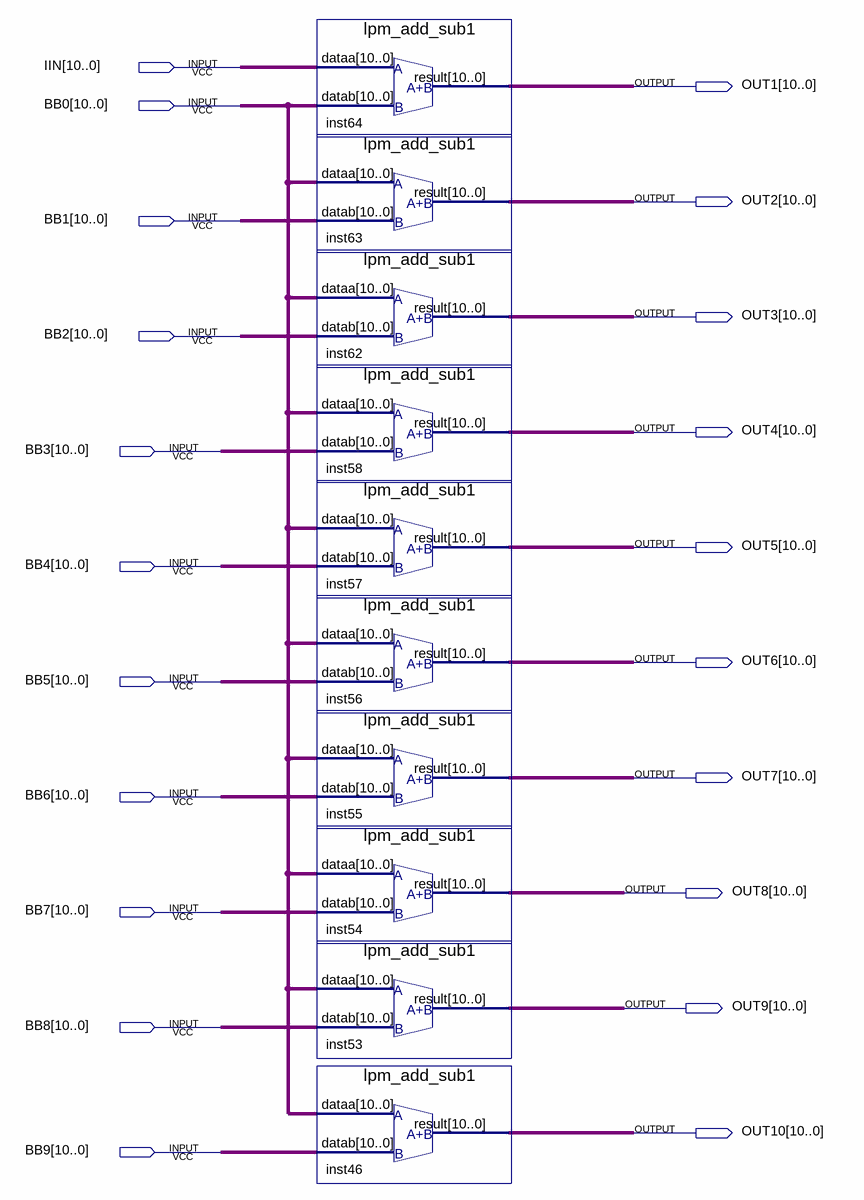
[diagram p0: schematic sheet]
// Quartus schematic ADDALL2.bdf as structural Verilog: 10 symbols, 21 pins
module ADDALL2 (
  input  [10:0] IIN,
  input  [10:0] BB0,
  input  [10:0] BB1,
  input  [10:0] BB2,
  input  [10:0] BB3,
  input  [10:0] BB4,
  input  [10:0] BB5,
  input  [10:0] BB6,
  input  [10:0] BB7,
  input  [10:0] BB8,
  input  [10:0] BB9,
  output [10:0] OUT1,
  output [10:0] OUT2,
  output [10:0] OUT3,
  output [10:0] OUT4,
  output [10:0] OUT5,
  output [10:0] OUT6,
  output [10:0] OUT7,
  output [10:0] OUT8,
  output [10:0] OUT9,
  output [10:0] OUT10
);

  lpm_add_sub1 inst64 (.dataa(IIN), .datab(BB0), .result(OUT1));
  lpm_add_sub1 inst63 (.dataa(BB0), .datab(BB1), .result(OUT2));
  lpm_add_sub1 inst62 (.dataa(BB0), .datab(BB2), .result(OUT3));
  lpm_add_sub1 inst58 (.dataa(BB0), .datab(BB3), .result(OUT4));
  lpm_add_sub1 inst57 (.dataa(BB0), .datab(BB4), .result(OUT5));
  lpm_add_sub1 inst56 (.dataa(BB0), .datab(BB5), .result(OUT6));
  lpm_add_sub1 inst55 (.dataa(BB0), .datab(BB6), .result(OUT7));
  lpm_add_sub1 inst54 (.dataa(BB0), .datab(BB7), .result(OUT8));
  lpm_add_sub1 inst53 (.dataa(BB0), .datab(BB8), .result(OUT9));
  lpm_add_sub1 inst46 (.dataa(BB0), .datab(BB9), .result(OUT10));
endmodule
